# EAGLE schematic Iridium Carrier (2) (EAGLE 9.5.1)

## Sheet 1 of 3
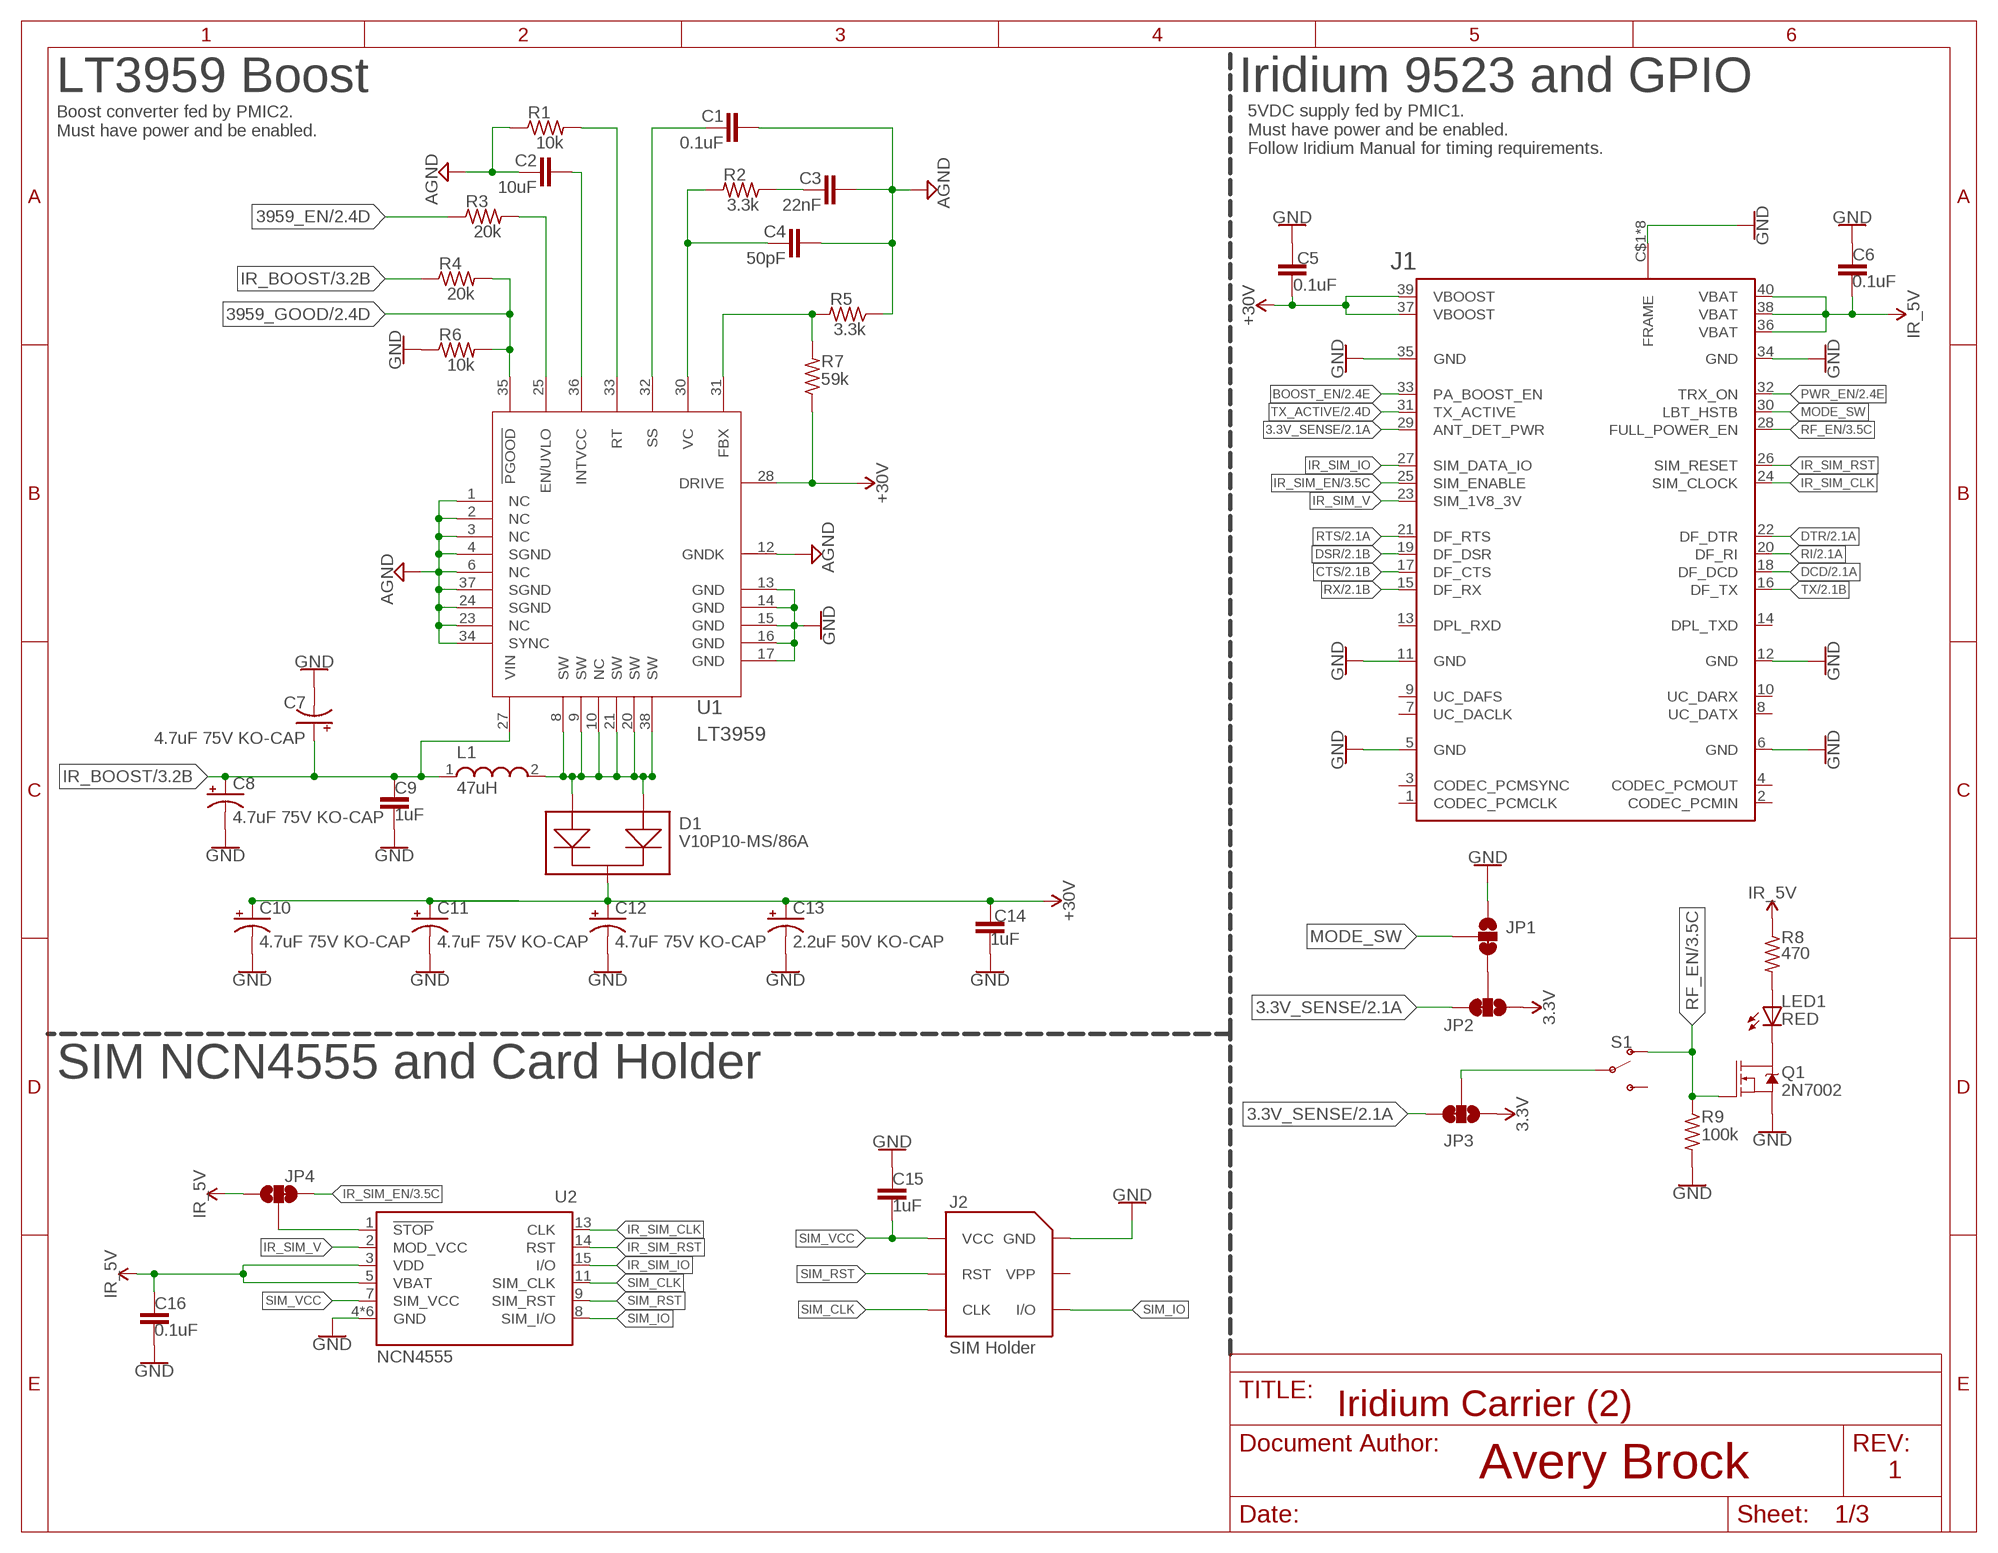
[diagram p0: schematic, sheet 1]
FRAME1 (FRAME_A_L): TITLE: Iridium 9523 Carrier

### Parts
C1  0.1uF  C-EUC0603  [C0603]
C2  10uF  C-EUC0603  [C0603]
C3  22nF  C-EUC0603  [C0603]
C4  50pF  C-EUC0603  [C0603]
C5  0.1uF  C-EUC0603  [C0603]
C6  0.1uF  C-EUC0603  [C0603]
C7  4.7uF 75V KO-CAP  CPOL-USD/7343-31R  [D/7343-31R]
C8  4.7uF 75V KO-CAP  CPOL-USD/7343-31R  [D/7343-31R]
C9  1uF  C-EUC0603  [C0603]
C10  4.7uF 75V KO-CAP  CPOL-USD/7343-31R  [D/7343-31R]
C11  4.7uF 75V KO-CAP  CPOL-USD/7343-31R  [D/7343-31R]
C12  4.7uF 75V KO-CAP  CPOL-USD/7343-31R  [D/7343-31R]
C13  2.2uF 50V KO-CAP  CPOL-USCT3528  [CT3528]
C14  1uF  C-EUC0603  [C0603]
C15  1uF  C-EUC0603  [C0603]
C16  0.1uF  C-EUC0603  [C0603]
D1  V10P10-MS/86A  [DIODE_TO-277A]
J1  Molex 0541020404  IRIDIUM-9523DEFAULT  [IRIDIUM-9523]
J2  SIM Holder  SIMHOLDERSIM  [SIMHOLDER]
JP1  OP MODE  JUMPER-SMT_3_1-NC_TRACE_SILK  [SMT-JUMPER_3_1-NC_TRACE_SILK]
JP2  Sense V  JUMPER-SMT_3_1-NC_TRACE_SILK  [SMT-JUMPER_3_1-NC_TRACE_SILK]
JP3  Sense V  JUMPER-SMT_3_1-NC_TRACE_SILK  [SMT-JUMPER_3_1-NC_TRACE_SILK]
JP4  SIM_STOP  JUMPER-SMT_3_1-NC_TRACE_SILK  [SMT-JUMPER_3_1-NC_TRACE_SILK]
L1  47uH  WE-HCI_1890  [WE-HCI_1890]
LED1  RED  LEDCHIP-LED0805  [CHIP-LED0805]
Q1  2N7002  MOSFET-NCH-AO3404A  [SOT23-3]
R1  10k  R-US_R0603  [R0603]
R2  3.3k  R-US_R0603  [R0603]
R3  20k  R-US_R0603  [R0603]
R4  20k  R-US_R0603  [R0603]
R5  3.3k  R-US_R0603  [R0603]
R6  10k  R-US_R0603  [R0603]
R7  59k  R-US_R0603  [R0603]
R8  470  R-US_R0603  [R0603]
R9  100k  R-US_R0603  [R0603]
S1  FULL RF PWR  SWITCH-SPDT-PTH-11.6X4.0MM  [SWITCH_SPDT_PTH_11.6X4.0MM]
U1  LT3959  [QFN-36_UHEMA]
U2  DAVID-HANDY_ON_NCN4555DEFAULT  [DAVID-HANDY_QFN16-3X3MM]

### Nets
3.3V: JP2.1 JP3.1 ; also sheet 2,3
3.3V_SENSE: J1.29(ANT_DET_PWR) JP2.3 JP3.3 ; also sheet 2,3
3959_EN: R3.1 ; also sheet 2
3959_GOOD: R4.2 R6.2 U1.35(!PGOOD!) ; also sheet 2
AGND: C1.2 C2.1 C3.2 C4.2 R1.1 R5.1 U1.1(NC) U1.2(NC) U1.3(NC) U1.4(SGND) U1.6(NC) U1.12(GNDK) U1.23(NC) U1.24(SGND) U1.34(SYNC) U1.37(SGND)
BOOST_EN: J1.33(PA_BOOST_EN) ; also sheet 2,3
CTS: J1.17(DF_CTS) ; also sheet 2
DCD: J1.18(DF_DCD) ; also sheet 2
DSR: J1.19(DF_DSR) ; also sheet 2
DTR: J1.22(DF_DTR) ; also sheet 2
GND: C5.1 C6.1 C7.- C8.- C9.2 C10.- C11.- C12.- C13.- C14.2 C15.1 C16.1 J1.5(GND) J1.6(GND) J1.11(GND) J1.12(GND) J1.34(GND) J1.35(GND) J1.C$1(FRAME) J1.C$2(FRAME) J1.C$3(FRAME) J1.C$4(FRAME) J1.C$5(FRAME) J1.C$6(FRAME) J1.C$7(FRAME) J1.C$8(FRAME) J2.C5(GND) JP1.1 Q1.2(S) R6.1 R9.2 U1.13(GND) U1.14(GND) U1.15(GND) U1.16(GND) U1.17(GND) U2.4(GND) U2.6(GND) U2.10(GND) U2.12(GND) U2.16(GND) U2.EXT(GND) ; also sheet 2,3
IR_BOOST: C7.+ C8.+ C9.1 L1.1 R4.1 U1.27(VIN) ; also sheet 3
IR_SIM_CLK: J1.24(SIM_CLOCK) U2.13(CLK)
IR_SIM_EN: J1.25(SIM_ENABLE) JP4.3 ; also sheet 3
IR_SIM_IO: J1.27(SIM_DATA_IO) U2.15(I/O)
IR_SIM_RST: J1.26(SIM_RESET) U2.14(RST)
IR_SIM_V: J1.23(SIM_1V8_3V) U2.2(MOD_VCC)
MODE_SW: J1.30(LBT_HSTB) JP1.2
N$1: JP4.2 U2.1(!STOP)
N$2: D1.1 D1.2 L1.2 U1.8(SW) U1.9(SW) U1.10(NC) U1.20(SW) U1.21(SW) U1.38(SW)
N$3: C2.2 U1.36(INTVCC)
N$4: JP1.3 JP2.2
N$5: C1.1 U1.32(SS)
N$6: R1.2 U1.33(RT)
N$7: LED1.C Q1.3(D)
N$8: C4.1 R2.2 U1.30(VC)
N$9: C3.1 R2.1
N$10: R5.2 R7.2 U1.31(FBX)
N$11: JP3.2 S1.2(P)
N$13: LED1.A R8.2
N$33: R3.2 U1.25(EN/UVLO)
PWR_EN: J1.32(TRX_ON) ; also sheet 2
RF_EN: J1.28(FULL_POWER_EN) Q1.1(G) R9.1 S1.1(O) ; also sheet 3
RI: J1.20(DF_RI) ; also sheet 2
RTS: J1.21(DF_RTS) ; also sheet 2
RX: J1.15(DF_RX) ; also sheet 2
SIM_CLK: J2.C3(CLK) U2.11(SIM_CLK)
SIM_IO: J2.C7(I/O) U2.8(SIM_I/O)
SIM_RST: J2.C2(RST) U2.9(SIM_RST)
SIM_VCC: C15.2 J2.C1(VCC) U2.7(SIM_VCC)
TX: J1.16(DF_TX) ; also sheet 2
TX_ACTIVE: J1.31(TX_ACTIVE) ; also sheet 2,3
V_BATT: C6.2 C16.2 J1.36(VBAT) J1.38(VBAT) J1.40(VBAT) JP4.1 R8.1 U2.3(VDD) U2.5(VBAT) ; supply symbol labelled IR_5V ; also sheet 3
VCC [30V]: C5.2 C10.+ C11.+ C12.+ C13.+ C14.1 D1.3 J1.37(VBOOST) J1.39(VBOOST) R7.1 U1.28(DRIVE) ; supply symbol labelled +30V
Unconnected: J1.1(CODEC_PCMCLK) J1.2(CODEC_PCMIN) J1.3(CODEC_PCMSYNC) J1.4(CODEC_PCMOUT) J1.7(UC_DACLK) J1.8(UC_DATX) J1.9(UC_DAFS) J1.10(UC_DARX) J1.13(DPL_RXD) J1.14(DPL_TXD) J2.C6(VPP) S1.3(S)

### Notes on the sheet
- LT3959 Boost | Iridium 9523 and GPIO
- Boost converter fed by PMIC2.
  Must have power and be enabled.
- 5VDC supply fed by PMIC1.
  Must have power and be enabled.
  Follow Iridium Manual for timing requirements.
- SIM NCN4555 and Card Holder
- NCN4555
- 1

## Sheet 2 of 3
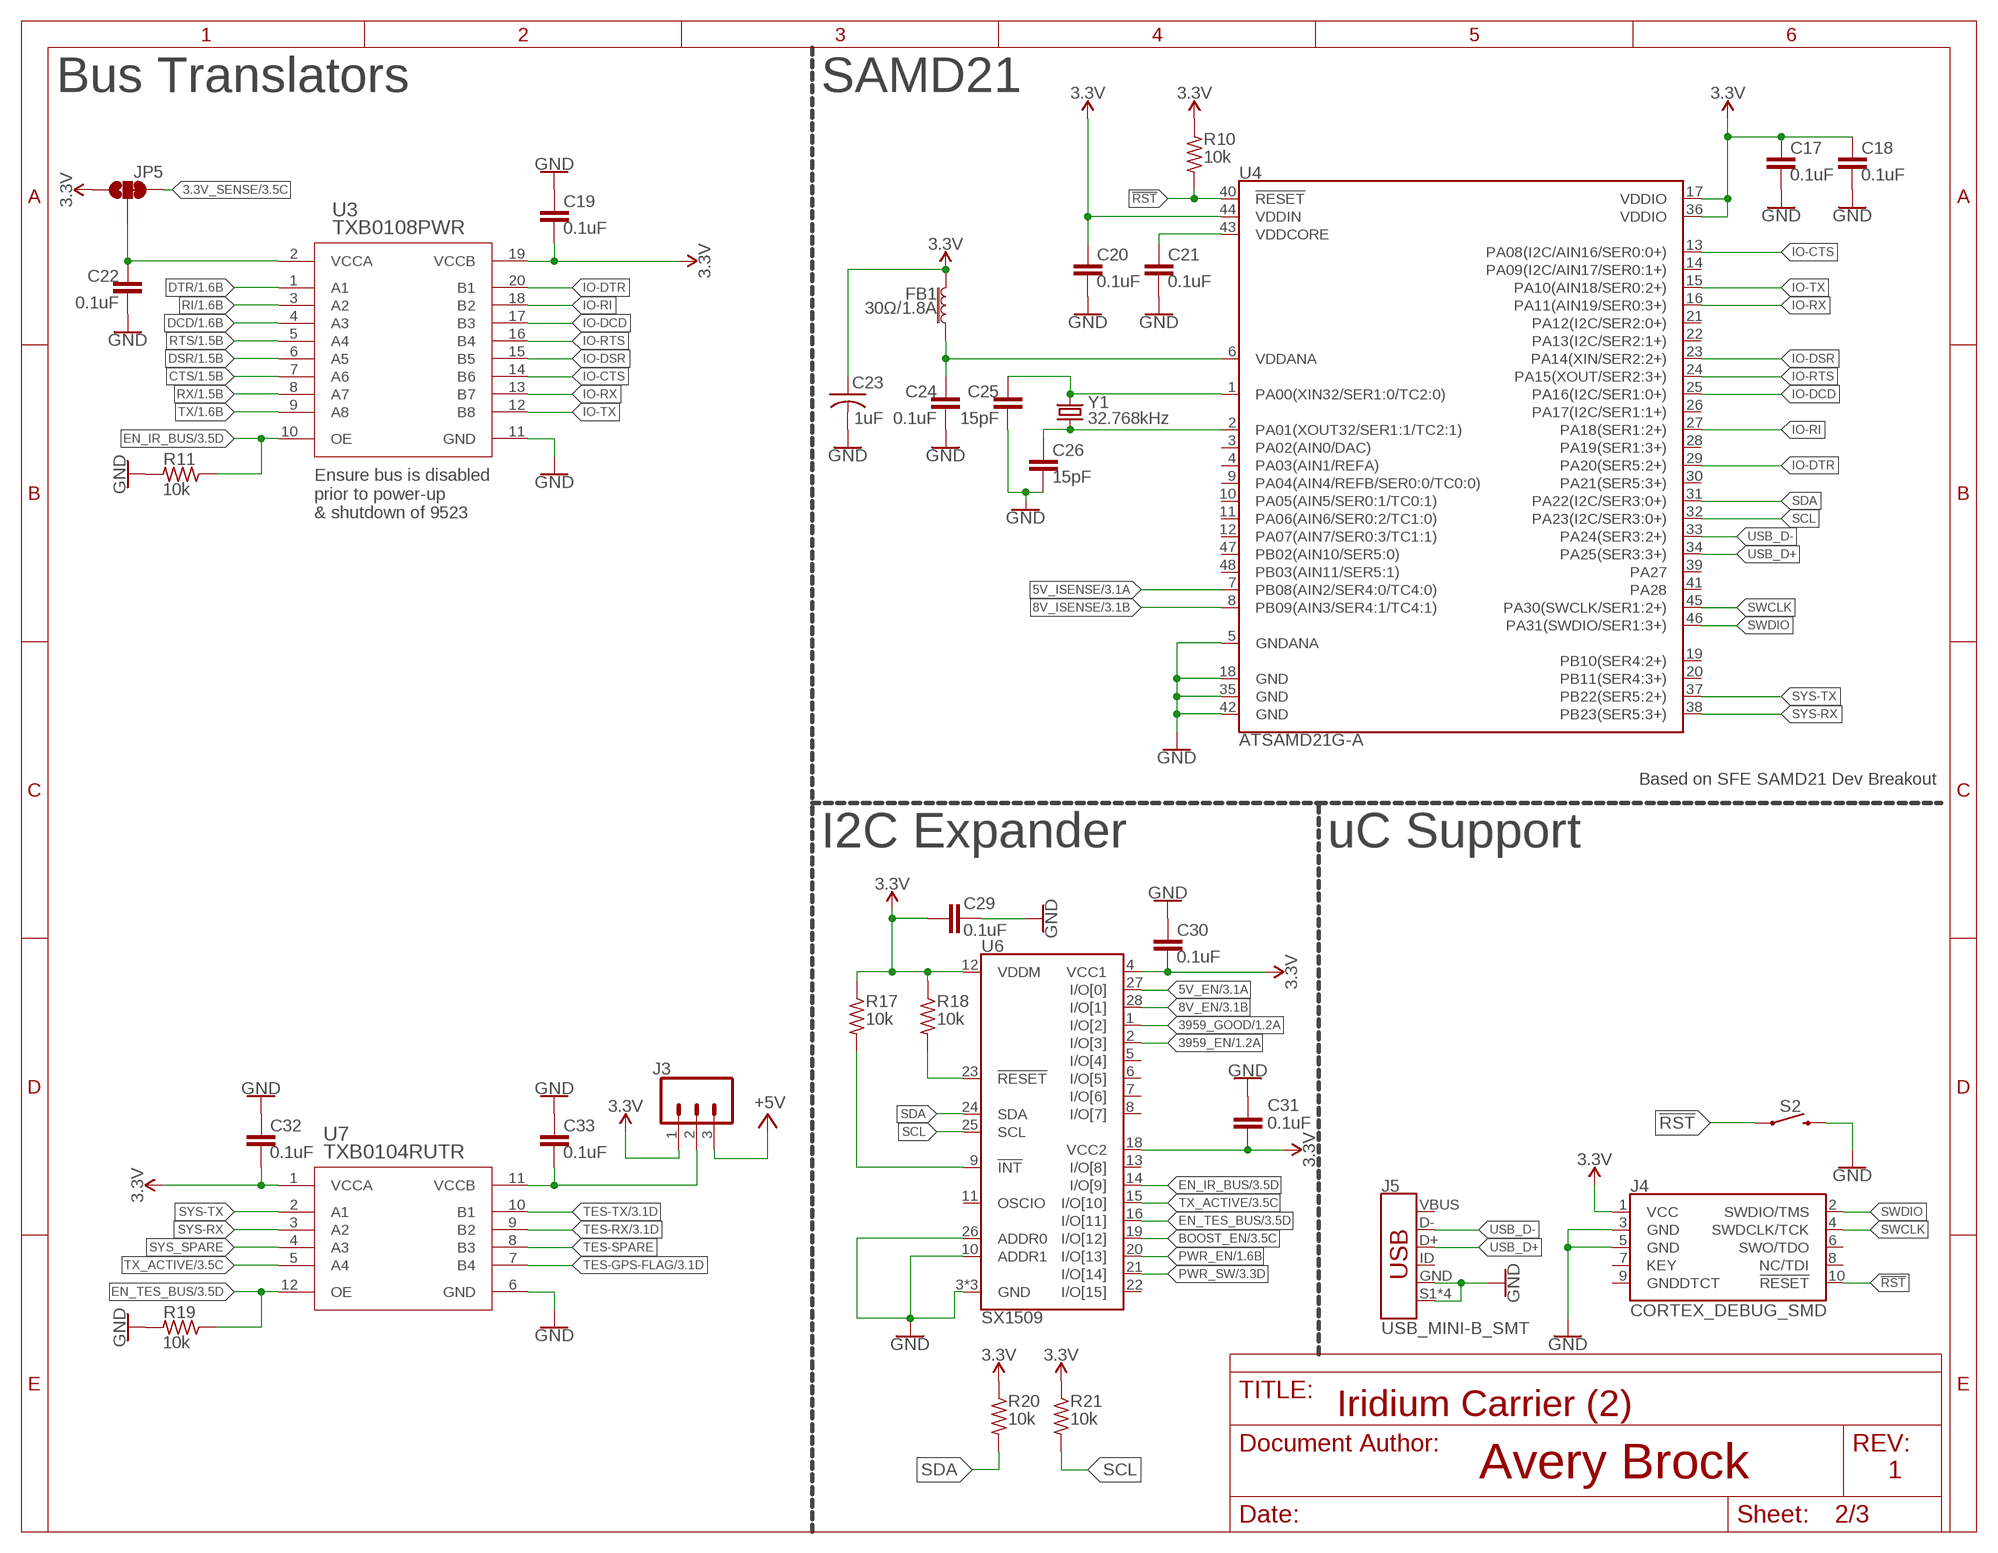
[diagram p1: schematic, sheet 2]
FRAME2 (FRAME_A_L): TITLE: Iridium 9523 Carrier

### Parts
C17  0.1uF  C-EUC0603  [C0603]
C18  0.1uF  C-EUC0603  [C0603]
C19  0.1uF  C-EUC0603  [C0603]
C20  0.1uF  C-EUC0603  [C0603]
C21  0.1uF  C-EUC0603  [C0603]
C22  0.1uF  C-EUC0603  [C0603]
C23  1uF  C-USC0805  [C0805]
C24  0.1uF  C-EUC0603  [C0603]
C25  15pF  C-EUC0603  [C0603]
C26  15pF  C-EUC0603  [C0603]
C29  0.1uF  C-EUC0603  [C0603]
C30  0.1uF  C-EUC0603  [C0603]
C31  0.1uF  C-EUC0603  [C0603]
C32  0.1uF  C-EUC0603  [C0603]
C33  0.1uF  C-EUC0603  [C0603]
FB1  30Ω/1.8A  FERRITE_BEAD-0603  [0603]
J3  455-1750-1-ND  CONN_03  [1X03]
J4  CORTEX_DEBUG_SMD  [SAMTECH_FTSH-105-01]
J5  USB_MINI-B_SMT  [USB-MINIB]
JP5  BUS_V  JUMPER-SMT_3_1-NC_TRACE_SILK  [SMT-JUMPER_3_1-NC_TRACE_SILK]
R10  10k  R-US_R0603  [R0603]
R11  10k  R-US_R0603  [R0603]
R17  10k  R-US_R0603  [R0603]
R18  10k  R-US_R0603  [R0603]
R19  10k  R-US_R0603  [R0603]
R20  10k  R-US_R0603  [R0603]
R21  10k  R-US_R0603  [R0603]
S2  RST BTN  MOMENTARY-SWITCH-SPST-SMD-6.0X3.5MM  [TACTILE_SWITCH_SMD_6.0X3.5MM]
U3  TXB0108PWR  [PW20]
U4  ATSAMD21G-A  [TQFP-48]
U6  SX1509  [QFN-28]
U7  TXB0104RUTR  [RUT12]
Y1  32.768kHz  CRYSTAL-32.768KHZSMD-3.2X1.5  [CRYSTAL-SMD-3.2X1.5MM]

### Nets
3.3V: C17.1 C18.1 C19.2 C20.1 C23.1 C29.1 C30.2 C31.2 C32.2 FB1.2 J3.1 J4.1(VCC) JP5.1 R10.1 R17.1 R18.1 R20.1 R21.1 U3.19(VCCB) U4.17(VDDIO) U4.36(VDDIO) U4.44(VDDIN) U6.4(VCC1) U6.12(VDDM) U6.18(VCC2) U7.1(VCCA) ; also sheet 1,3
3.3V_SENSE: JP5.3 ; also sheet 1,3
5V_EN: U6.27(I/O[0]) ; also sheet 3
5V_ISENSE: U4.7(PB08(AIN2/SER4:0/TC4:0)) ; also sheet 3
8V_EN: U6.28(I/O[1]) ; also sheet 3
8V_ISENSE: U4.8(PB09(AIN3/SER4:1/TC4:1)) ; also sheet 3
3959_EN: U6.2(I/O[3]) ; also sheet 1
3959_GOOD: U6.1(I/O[2]) ; also sheet 1
!RST: J4.10(!RESET) R10.2 S2.1 U4.40(!RESET!)
+5V: J3.3 ; also sheet 3
BOOST_EN: U6.19(I/O[12]) ; also sheet 1,3
CTS: U3.7(A6) ; also sheet 1
DCD: U3.4(A3) ; also sheet 1
DSR: U3.6(A5) ; also sheet 1
DTR: U3.1(A1) ; also sheet 1
EN_IR_BUS: R11.1 U3.10(OE) U6.14(I/O[9]) ; also sheet 3
EN_TES_BUS: R19.1 U6.16(I/O[11]) U7.12(OE) ; also sheet 3
GND: C17.2 C18.2 C19.1 C20.2 C21.2 C22.1 C23.2 C24.2 C25.2 C26.2 C29.2 C30.1 C31.1 C32.1 C33.1 J4.3(GND) J4.5(GND) J5.GND J5.S1(SHIELD) J5.S2(SHIELD) J5.S3(SHIELD) J5.S4(SHIELD) R11.2 R19.2 S2.2 U3.11(GND) U4.5(GNDANA) U4.18(GND) U4.35(GND) U4.42(GND) U6.3(GND) U6.10(ADDR1) U6.17(GND) U6.26(ADDR0) U6.29(GND) U7.6(GND) ; also sheet 1,3
IO-CTS: U3.14(B6) U4.13(PA08(I2C/AIN16/SER0:0+))
IO-DCD: U3.17(B3) U4.25(PA16(I2C/SER1:0+))
IO-DSR: U3.15(B5) U4.23(PA14(XIN/SER2:2+))
IO-DTR: U3.20(B1) U4.29(PA20(SER5:2+))
IO-RI: U3.18(B2) U4.27(PA18(SER1:2+))
IO-RTS: U3.16(B4) U4.24(PA15(XOUT/SER2:3+))
IO-RX: U3.13(B7) U4.16(PA11(AIN19/SER0:3+))
IO-TX: U3.12(B8) U4.15(PA10(AIN18/SER0:2+))
N$14: C22.2 JP5.2 U3.2(VCCA)
N$15: C33.2 J3.2 U7.11(VCCB)
N$17: C24.1 FB1.1 U4.6(VDDANA)
N$18: C21.1 U4.43(VDDCORE)
N$19: C25.1 U4.1(PA00(XIN32/SER1:0/TC2:0)) Y1.P$2
N$20: C26.1 U4.2(PA01(XOUT32/SER1:1/TC2:1)) Y1.P$1
N$71: R17.2 U6.9(!INT)
N$72: R18.2 U6.23(!RESET)
PWR_EN: U6.20(I/O[13]) ; also sheet 1
PWR_SW: U6.21(I/O[14]) ; also sheet 3
RI: U3.3(A2) ; also sheet 1
RTS: U3.5(A4) ; also sheet 1
RX: U3.8(A7) ; also sheet 1
SCL: R21.2 U4.32(PA23(I2C/SER3:0+)) U6.25(SCL)
SDA: R20.2 U4.31(PA22(I2C/SER3:0+)) U6.24(SDA)
SWCLK: J4.4(SWDCLK/TCK) U4.45(PA30(SWCLK/SER1:2+))
SWDIO: J4.2(SWDIO/TMS) U4.46(PA31(SWDIO/SER1:3+))
SYS-RX: U4.38(PB23(SER5:3+)) U7.3(A2)
SYS-TX: U4.37(PB22(SER5:2+)) U7.2(A1)
SYS_SPARE: U7.4(A3)
TES-GPS-FLAG: U7.7(B4) ; also sheet 3
TES-RX: U7.9(B2) ; also sheet 3
TES-SPARE: U7.8(B3)
TES-TX: U7.10(B1) ; also sheet 3
TX: U3.9(A8) ; also sheet 1
TX_ACTIVE: U6.15(I/O[10]) U7.5(A4) ; also sheet 1,3
USB_D+: J5.D+ U4.34(PA25(SER3:3+))
USB_D-: J5.D- U4.33(PA24(SER3:2+))
Unconnected: J4.6(SWO/TDO) J4.7(KEY) J4.8(NC/TDI) J4.9(GNDDTCT) J5.ID U4.3(PA02(AIN0/DAC)) U4.4(PA03(AIN1/REFA)) U4.9(PA04(AIN4/REFB/SER0:0/TC0:0)) U4.10(PA05(AIN5/SER0:1/TC0:1)) U4.11(PA06(AIN6/SER0:2/TC1:0)) U4.12(PA07(AIN7/SER0:3/TC1:1)) U4.14(PA09(I2C/AIN17/SER0:1+)) U4.19(PB10(SER4:2+)) U4.20(PB11(SER4:3+)) U4.21(PA12(I2C/SER2:0+)) U4.22(PA13(I2C/SER2:1+)) U4.26(PA17(I2C/SER1:1+)) U4.28(PA19(SER1:3+)) U4.30(PA21(SER5:3+)) U4.39(PA27) U4.41(PA28) U4.47(PB02(AIN10/SER5:0)) U4.48(PB03(AIN11/SER5:1)) U6.5(I/O[4]) U6.6(I/O[5]) U6.7(I/O[6]) U6.8(I/O[7]) U6.11(OSCIO) U6.13(I/O[8]) U6.22(I/O[15])

### Notes on the sheet
- Bus Translators | SAMD21
- Ensure bus is disabled 
  prior to power-up
  & shutdown of 9523
- Based on SFE SAMD21 Dev Breakout
- I2C Expander | uC Support
- 1

## Sheet 3 of 3
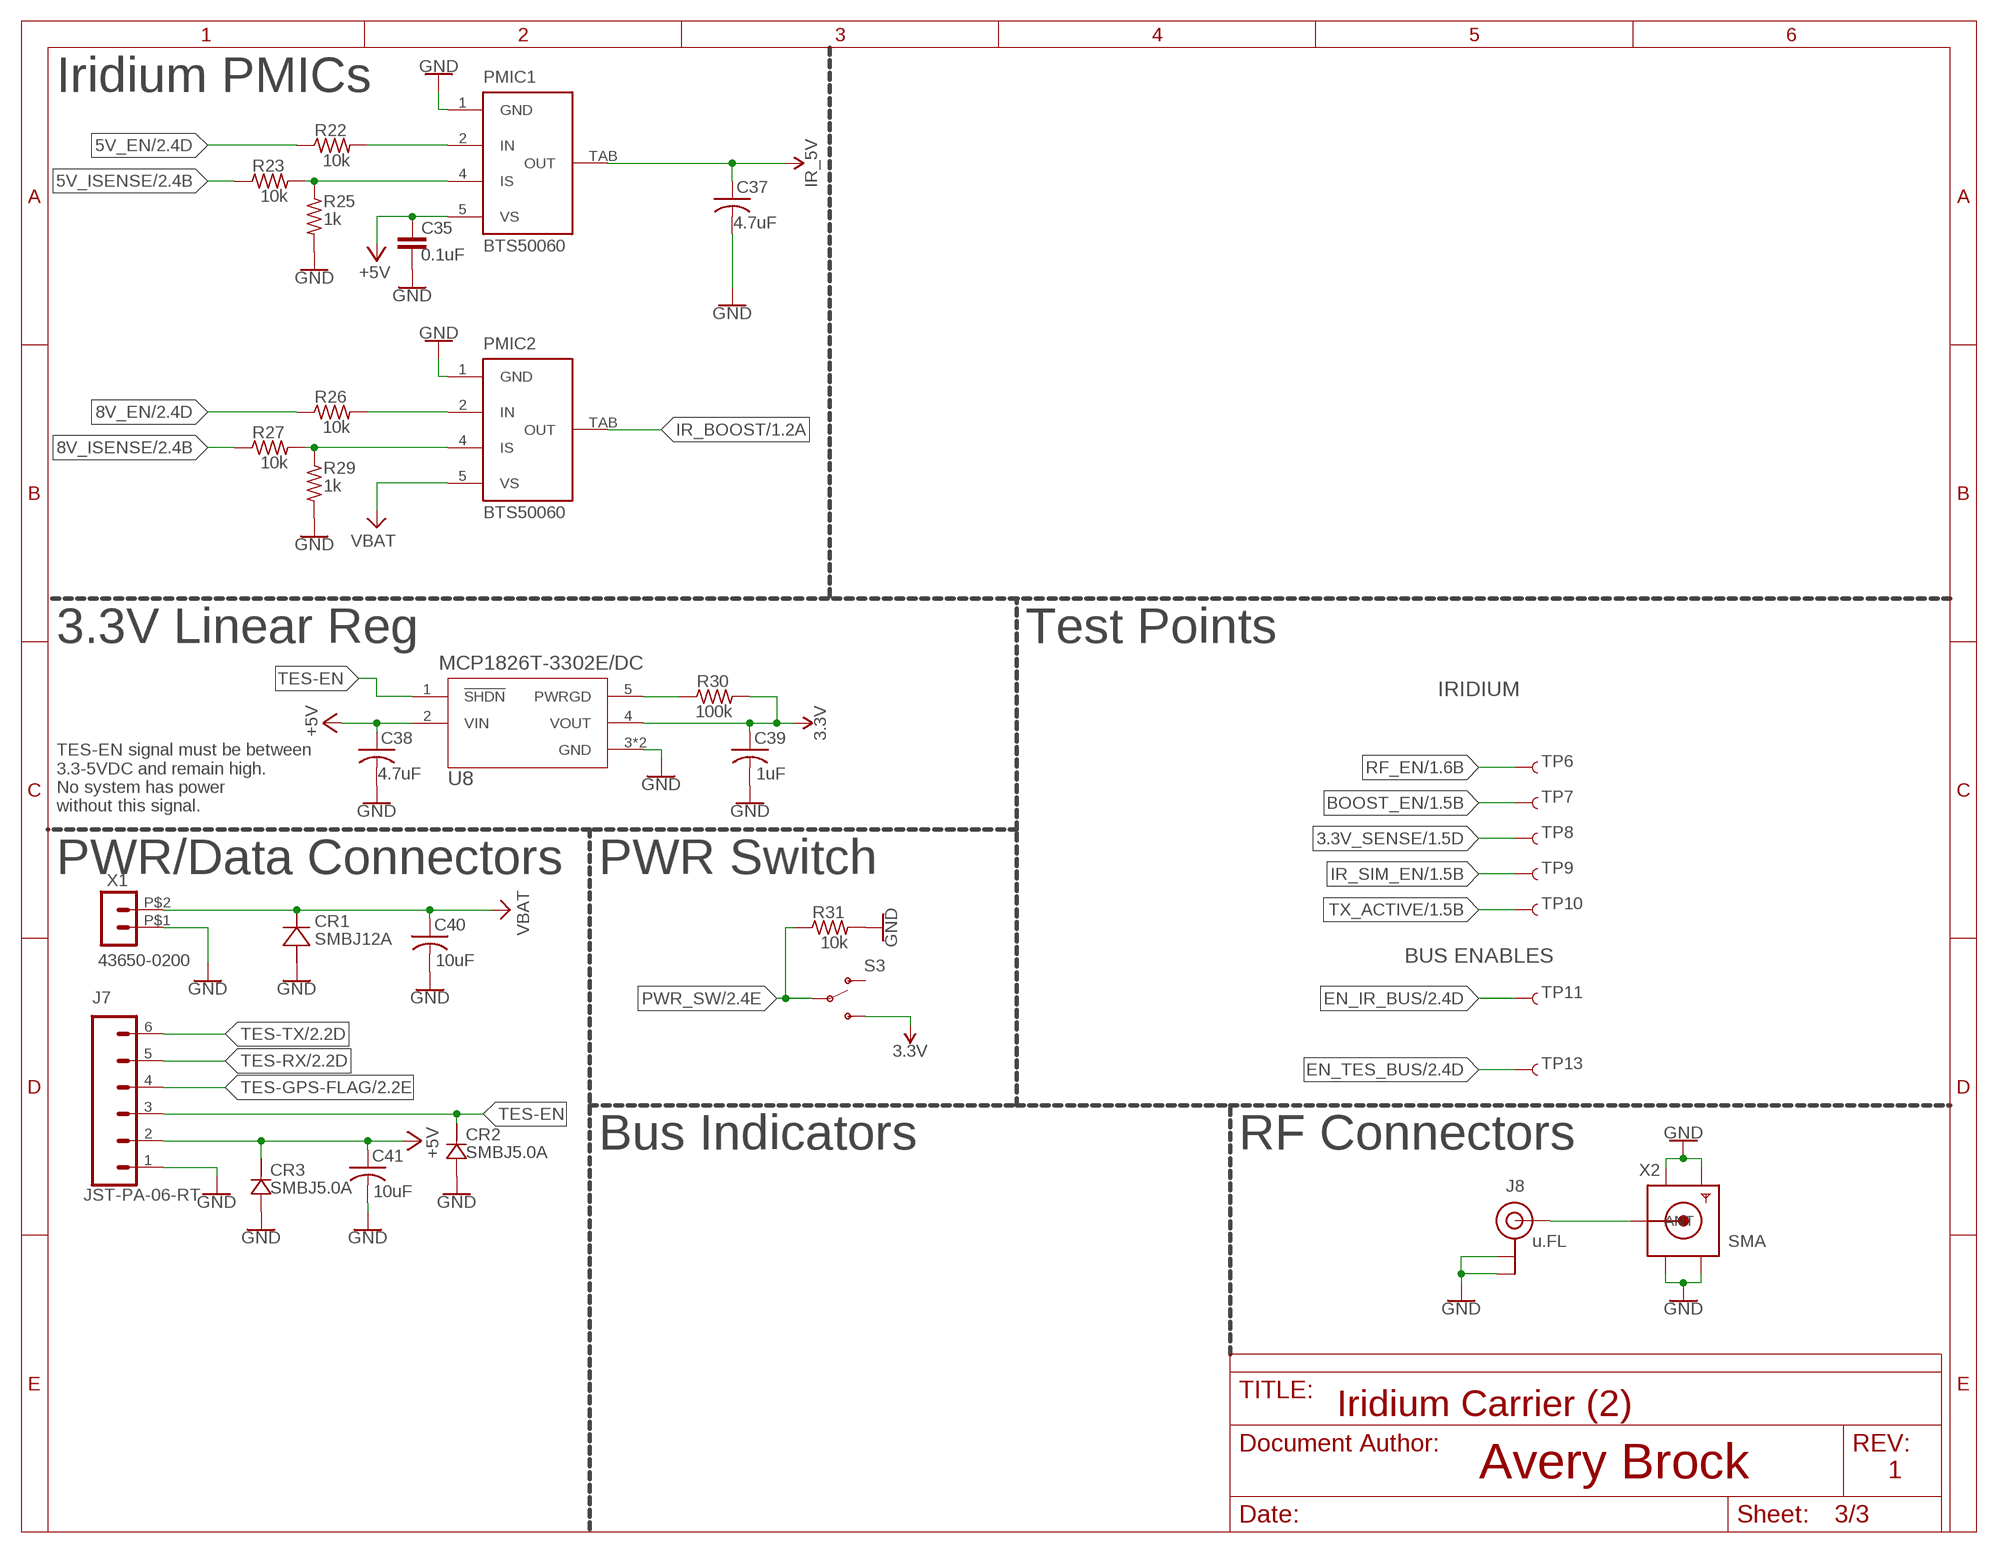
[diagram p2: schematic, sheet 3]
FRAME3 (FRAME_A_L): TITLE: Iridium 9523 Carrier

### Parts
C35  0.1uF  C-EUC0603  [C0603]
C37  4.7uF  C-USC1206  [C1206]
C38  4.7uF  C-USC1206  [C1206]
C39  1uF  C-USC0805  [C0805]
C40  10uF  C-USC1206  [C1206]
C41  10uF  C-USC1206  [C1206]
CR1  SMBJ12A  [SMB]
CR2  SMBJ5.0A  [DIODE_DO214AA]
CR3  SMBJ5.0A  [DIODE_DO214AA]
J7  JST-PA-06-RT  [1X6-JST-PA]
J8  U.FL  [U.FL]
PMIC1  BTS50060  [TO252-5-11]
PMIC2  BTS50060  [TO252-5-11]
R22  10k  R-US_R0603  [R0603]
R23  10k  R-US_R0603  [R0603]
R25  1k  R-US_R0603  [R0603]
R26  10k  R-US_R0603  [R0603]
R27  10k  R-US_R0603  [R0603]
R29  1k  R-US_R0603  [R0603]
R30  100k  R-US_R0603  [R0603]
R31  10k  R-US_R0603  [R0603]
S3  PWR SW  SWITCH-SPDT-PTH-11.6X4.0MM  [SWITCH_SPDT_PTH_11.6X4.0MM]
TP6  TEST-POINT3X4  [PAD.03X.04]
TP7  TEST-POINT3X4  [PAD.03X.04]
TP8  TEST-POINT3X4  [PAD.03X.04]
TP9  TEST-POINT3X4  [PAD.03X.04]
TP10  TEST-POINT3X4  [PAD.03X.04]
TP11  TEST-POINT3X4  [PAD.03X.04]
TP13  TEST-POINT3X4  [PAD.03X.04]
U8  MCP1826T-3302E/DC  [SOT-223_5MC]
X1  43650-0200  HEADER_POS2_43650-0200  [43650-0200]
X2  SMACONNECTOR  [SMA90_DIP]

### Nets
3.3V: C39.1 R30.2 S3.3(S) U8.4(VOUT) ; also sheet 1,2
3.3V_SENSE: TP8.P$1 ; also sheet 1,2
5V_EN: R22.1 ; also sheet 2
5V_ISENSE: R23.1 ; also sheet 2
8V_EN: R26.1 ; also sheet 2
8V_ISENSE: R27.1 ; also sheet 2
+5V: C35.1 C38.1 C41.1 CR3.1 J7.2 PMIC1.5(VS) U8.2(VIN) ; also sheet 2
BOOST_EN: TP7.P$1 ; also sheet 1,2
EN_IR_BUS: TP11.P$1 ; also sheet 2
EN_TES_BUS: TP13.P$1 ; also sheet 2
GND: C35.2 C37.2 C38.2 C39.2 C40.2 C41.2 CR1.2(CATHODE2) CR2.2 CR3.2 J7.1 J8.1(GND) J8.2(GND) PMIC1.1(GND) PMIC2.1(GND) R25.2 R29.2 R31.2 U8.3(GND) U8.P$1(GND) X1.P$1 X2.GND1 X2.GND2 X2.GND3 X2.GND4 ; also sheet 1,2
IR_BOOST: PMIC2.TAB(OUT) ; also sheet 1
IR_SIM_EN: TP9.P$1 ; also sheet 1
N$12: R30.1 U8.5(PWRGD)
N$26: PMIC2.4(IS) R27.2 R29.1
N$27: PMIC2.2(IN) R26.2
N$30: PMIC1.4(IS) R23.2 R25.1
N$31: PMIC1.2(IN) R22.2
N$75: J8.FEED(SIGNAL) X2.ANTENNA(ANT)
PWR_SW: R31.1 S3.2(P) ; also sheet 2
RF_EN: TP6.P$1 ; also sheet 1
TES-EN: CR2.1 J7.3 U8.1(!SHDN)
TES-GPS-FLAG: J7.4 ; also sheet 2
TES-RX: J7.5 ; also sheet 2
TES-TX: J7.6 ; also sheet 2
TX_ACTIVE: TP10.P$1 ; also sheet 1,2
V_BATT: C37.1 PMIC1.TAB(OUT) ; supply symbol labelled IR_5V ; also sheet 1
VBAT: C40.1 CR1.1(ANODE1) PMIC2.5(VS) X1.P$2
Unconnected: S3.1(O)

### Notes on the sheet
- Iridium PMICs
- 3.3V Linear Reg | Test Points
- IRIDIUM
- TES-EN signal must be between
  3.3-5VDC and remain high. 
  No system has power 
  without this signal.
- PWR/Data Connectors | PWR Switch
- BUS ENABLES
- Bus Indicators | RF Connectors
- u.FL | SMA
- 1

## Power pins joined to a net without a drawn wire
VBUS: J5.VBUS

## Library data of the parts
C1-C6 C9 C14-C22 C24-C26 C29-C33 C35 = rcl:C-EU: CAPACITOR, European symbol; SPICEPREFIX: C
C7 C8 C10-C13 = rcl:CPOL-US: POLARIZED CAPACITOR, American symbol; SPICEPREFIX: C
C23 C37-C41 = adafruit:C-US: CAPACITOR, American symbol
CR1 = SMBJ12A:SMBJ12A; MANUFACTURER_PART_NUMBER: SMBJ12A; VENDOR: AVX Corporation
CR2 CR3 = SMBJ5 TVS:SMBJ5.0A; MANUFACTURER_PART_NUMBER: SMBJ5.0A; VENDOR: AVX Corporation
D1 = V10P10:V10P10-MS/86A
FB1 = SparkFun-Coils:FERRITE_BEAD: Ferrite Bead (blocks, cores, rings, chokes, etc.) Inductor with layers of ferrite used to suppress high frequencies. Often used to isolate high frequency noise. SparkFun Products: IOIO-OTG - V2.2 <https://www.sparkfun.com/products/13613> SparkFun SAMD21 Mini Breakout <https://www.sparkfun.com/products/13664> SparkFun 6 Degrees of Freedom Breakout - LSM6DS3 <https://www.sparkfun.com/products/13339> SparkFun SAMD21 Dev Breakout <https://www.sparkfun.com/products/13672>; PROD_ID: NDUC-13805
J1 = Iridium-9523:IRIDIUM-9523: Molex 53885-0408 Iridium 9523 pinout
J2 = SparkFun-Connectors:SIMHOLDER: SIM Cellular Card Socket SMT 6 pin standard connection. SparkFun Products: SIM Socket <https://www.sparkfun.com/products/548> SparkFun Cellular Shield - MG2639 <https://www.sparkfun.com/products/13120> SparkFun SIM Card Socket Breakout <https://www.sparkfun.com/products/573>; PROD_ID: CONN-08536; SF_ID: PRT-00548
J3 = SparkFun-Connectors:CONN_03: Multi connection point. Often used as Generic Header-pin footprint for 0.1 inch spaced/style header connections On any of the 0.1 inch spaced packages, you can populate with these: Break Away Headers - Straight <https://www.sparkfun.com/products/116> (PRT-00116) Break Away Male Headers - Right Angle <https://www.sparkfun.com/products/553> (PRT-00553) Female Headers <https://www.sparkfun.com/products/115> (PRT-00115) Break Away Headers - Machine Pin <https://www.sparkfun.com/products/117> (PRT-00117) Break Away Female Headers - Swiss Machine Pin <https://www.sparkfun.com/products/743> (PRT-00743) Stackable Header - 3 Pin (Female, 0.1") <https://www.sparkfun.com/products/13875> (PRT-13875) For SCREWTERMINALS and SPRING TERMINALS visit here: Screw Terimnals on SparkFun.com <https://www.sparkfun.com/search/results?term=Screw+Terminals> (5mm/3.5mm/2.54mm spacing) This device is also useful as a general connection point to wire up your design to another part of your project. Our various solder wires solder well into these plated through hole pads. Hook-Up Wire - Assortment (Stranded, 22 AWG) <https://www.sparkfun.com/products/11375> (PRT-11375) Hook-Up Wire - Assortment (Solid Core, 22 AWG) <https://www.sparkfun.com/products/11367> (PRT-11367) View the entire wire category on our website here <https://www.sparkfun.com/categories/141> Special notes: Molex polarized connector foot print use with SKU : PRT-08232 with associated crimp pins and housings.; PROD_ID: XXX-00000
J4 = SparkFun-Connectors:CORTEX_DEBUG: Cortex Debug Connector - 10 pin Supports JTAG debug, Serial Wire debug, and Serial Wire Viewer. PTH and SMD connector options available. General Connector Information <http://infocenter.arm.com/help/topic/com.arm.doc.faqs/attached/13634/cortex_debug_connectors.pdf> Products: PTH Connector <http://www.digikey.com/product-detail/en/cnc-tech/3220-10-0100-00/1175-1627-ND/3883661> -via Digi-Key SparkFun PSoc <https://www.sparkfun.com/products/13229> SparkFun T <https://www.sparkfun.com/products/13810>
J5 = SparkFun-Connectors:USB_MINI-B: USB type Mini-B Connector Breaks out 5th pin, and includes shield pins if needed. SparkFun Products: SparkFun FTDI Basic Breakout <https://www.sparkfun.com/products/9716> SparkFun XBee Explorer USB <https://www.sparkfun.com/products/11812> SparkFun Redboard <https://www.sparkfun.com/products/12757>; PROD_ID: CONN-08193; SF_ID: PRT-00587
J7 = SparkFun-Connectors:JST-PA-06-RT
J8 = SparkFun-Connectors:U.FL: SMD Antenna Connector - U.FL 2mm height, 3.0mm x 3.0mm receptacle size. SparkFun Products: SparkFun WiFi Shield - ESP8266 <https://www.sparkfun.com/products/13287> SparkFun ESP8266 Thing <https://www.sparkfun.com/products/13231> SparkFun MiniGen - Pro Mini Signal Generator Shield <https://www.sparkfun.com/products/11420>; PROD_ID: CONN-09193; SF_ID: WRL-09144
JP1-JP5 = SparkFun-Jumpers:JUMPER-SMT_3_1-NC_TRACE: Normally closed trace jumper (1 of 2 connections) This jumper has a trace between two pads so it's normally closed (NC). The other connection is normally open (NO). Use a razor knife to open the connection. For best results follow the IPC guidelines for cutting traces: Cutout at least 0.063 mm (0.005 in). Remove all loose material to clean up the cut area. Seal the cut with an approved epoxy. Reapply solder to reclose the connection, or to close the NO connection.
L1 = Wurth_Elektronik_Passive_rev16c:WE-HCI: SMD Flat Wire High Current Inductor Characteristics Magnetically shielded Flat wire coil for low losses at high frequency Low stray field Operating temperature: –40 °C to +150/155 °C Applications Graphic cards Laptops Industrial computers Motherboards High current switching regulators DC/DC converter Polyphase-switching regulators Filter <http://katalog.we-online.de/media/images/eisos/IndHCI_pf2.jpg> Details see: http://katalog.we-online.de/en/pbs/WE-HCI? Updated by Dan Xu 2014-07-07 2014 (C) Wurth Elektronik
LED1 = adafruit:LED: LED OSRAM: - CHIPLED LG R971, LG N971, LY N971, LG Q971, LY Q971, LO R971, LY R971 LH N974, LH R974 LS Q976, LO Q976, LY Q976 LO Q996 - Hyper CHIPLED LW Q18S LB Q993, LB Q99A, LB R99A - SideLED LS A670, LO A670, LY A670, LG A670, LP A670 LB A673, LV A673, LT A673, LW A673 LH A674 LY A675 LS A676, LA A676, LO A676, LY A676, LW A676 LS A679, LY A679, LG A679 - Hyper Micro SIDELED® LS Y876, LA Y876, LO Y876, LY Y876 LT Y87S - SmartLED LW L88C, LW L88S LB L89C, LB L89S, LG L890 LS L89K, LO L89K, LY L89K LS L896, LA L896, LO L896, LY L896 - TOPLED LS T670, LO T670, LY T670, LG T670, LP T670 LSG T670, LSP T670, LSY T670, LOP T670, LYG T670 LG T671, LOG T671, LSG T671 LB T673, LV T673, LT T673, LW T673 LH T674 LS T676, LA T676, LO T676, LY T676, LB T676, LH T676, LSB T676, LW T676 LB T67C, LV T67C, LT T67C, LS T67K, LO T67K, LY T67K, LW E67C LS E67B, LA E67B, LO E67B, LY E67B, LB E67C, LV E67C, LT E67C LW T67C LS T679, LY T679, LG T679 LS T770, LO T770, LY T770, LG T770, LP T770 LB T773, LV T773, LT T773, LW T773 LH T774 LS E675, LA E675, LY E675, LS T675 LS T776, LA T776, LO T776, LY T776, LB T776 LHGB T686 LT T68C, LB T68C - Hyper Mini TOPLED® LB M676 - Mini TOPLED Santana® LG M470 LS M47K, LO M47K, LY M47K Source: http://www.osram.convergy.de/
PMIC1 PMIC2 = infineon:BTS50060
Q1 = SparkFun-DiscreteSemi:MOSFET-NCH: N-channel MOSFETs Voltage controlled devices that allow control of high current outputs. SparkFun Products: SparkFun OpenScale <https://www.sparkfun.com/products/13261> SparkFun Digital Sandbox <https://www.sparkfun.com/products/12651> SparkFun Monster Moto Shield <https://www.sparkfun.com/products/10182> SparkFun MOSFET Power Controller <https://www.sparkfun.com/products/11214>; PROD_ID: TRANS-12988; VALUE: 5.8A/30V/35mΩ
R1-R11 R17-R23 R25-R27 R29-R31 = adafruit:R-US_: RESISTOR, American symbol
S1 S3 = SparkFun-Switches:SWITCH-SPDT: Single Pole, Double Throw (SPDT) Switch Single-pole, double-throw (SPDT) switch. Variant Overview SMD-AYZ0202 Surface Mount DPDT Switch <https://www.sparkfun.com/products/597> (COM-00597) Used on e.g. LilyPad Arduino USB - ATmega32U4 Board <https://www.sparkfun.com/products/12049> PTH-11.6X4.0MM SPDT Mini Power Switch <https://www.sparkfun.com/products/102> (COM-00102) Used on e.g. SparkFun Simon Says - Through-Hole Soldering Kit <https://www.sparkfun.com/products/10547> (KIT-10547) PTH-11.6X4.0MM-KIT KIT version of SPDT Mini Power Switch - Simplifies soldering by removing tStop of switch pins - only one side can be soldered. PTH-11.6X4.0MM-LOCK LOCK version of SPDT Mini Power Switch - Offset pins hold switch in place for easier soldering. SMD-RIGHT-ANGLE Surface Mount Right Angle Switch <https://www.sparkfun.com/products/10860> (COM-10860) Used on e.g. SparkFun ESP8266 Thing <https://www.sparkfun.com/products/13231>; PROD_ID: SWCH-08261; SF_SKU: COM-00102
S2 = SparkFun-Switches:MOMENTARY-SWITCH-SPST: Momentary Switch (Pushbutton) - SPST Normally-open (NO) SPST momentary switches (buttons, pushbuttons). Variants PTH-12MM - 12mm square, through-hole Momentary Pushbutton Switch - 12mm Square <https://www.sparkfun.com/products/9190> (COM-09190) PTH-6.0MM, PTH-6.0MM-KIT - 6.0mm square, through-hole Mini Pushbutton Switch <https://www.sparkfun.com/products/97> (COM-00097) KIT package intended for soldering kit's - only one side of pads' copper is exposed. PTH-RIGHT-ANGLE-KIT - Right-angle, through-hole Right Angle Tactile Button <https://www.sparkfun.com/products/10791> - Used on SparkFun BigTime Watch Kit <https://www.sparkfun.com/products/11734> SMD-12MM - 12mm square, surface-mount Tactile Button - SMD (12mm) <https://www.sparkfun.com/products/12993> (COM-12993) Used on SparkFun PicoBoard <https://www.sparkfun.com/products/11888> SMD-4.5MM - 4.5mm Square Trackball Switch Used on SparkFun Blackberry Trackballer Breakout <https://www.sparkfun.com/products/13169> SMD-4.6MMX2.8MM - 4.60mm x 2.80mm, surface mount Used on SparkFun SAMD21 Mini Breakout <https://www.sparkfun.com/products/13664> SMD-5.2MM, SMD-5.2-REDUNDANT - 5.2mm square, surface-mount Mini Pushbutton Switch - SMD <https://www.sparkfun.com/products/8720> (COM-08720) Used on Arduino Pro Mini <https://www.sparkfun.com/products/11114> REDUNDANT package connects both switch circuits together SMD-6.0X3.5MM - 6.0 x 3.5mm, surface mount Momentary Reset Switch SMD <https://www.sparkfun.com/products/8229> (COM-08229) SMD-6.2MM-TALL - 6.2mm square, surface mount Tactile Button - SMD (6mm) <https://www.sparkfun.com/products/12992> Used on SparkFun Digital Sandbox <https://www.sparkfun.com/products/12651> SMD-RIGHT-ANGLE - Right-angle, surface mount Used on SparkFun Block for Intel® Edison - Arduino <https://www.sparkfun.com/products/13036>; PROD_ID: SWCH-00815; SF_SKU: COM-08229
TP6-TP11 TP13 = SparkFun-Connectors:TEST-POINT: SparkFun Test Points Bare copper test points for troubleshooting or In-Circuit-Testing. These are used by our Production team for verifying production board runs using pogo-pins on test beds. SparkFun Products: SparkFun LSM9DS1 Breakout <https://www.sparkfun.com/products/13284> SparkFun PSOC <https://www.sparkfun.com/products/13714> SparkFun Load Cell Amplifier <https://www.sparkfun.com/products/13879>
U1 = LT3959QFN:LT3959
U2 = NCN4555:DAVID-HANDY_ON_NCN4555: ON NCN4555; SPICEPREFIX: X
U3 = TXB0108-PWR:TXB0108PWR; MANUFACTURER_PART_NUMBER: TXB0108PWR; VENDOR: Texas Instruments
U4 = SparkFun-IC-Microcontroller:ATSAMD21G: Atmel SAMD21G SMART ARM-Based Microcontroller The Atmel ® | SMART ™ SAM D21 is a series of low-power microcontrollers using the 32-bit ARM ® Cortex ® -M0+ processor, and ranging from 32- to 64-pins with up to 256KB Flash and 32KB of SRAM. The SAM D21 devices operate at a maximum frequency of 48MHz and reach 2.46 CoreMark/MHz. They are designed for simple and intuitive migration with identical peripheral modules, hex compatible code, identical linear address map and pin compatible migration paths between all devices in the product series. All devices include intelligent and flexible peripherals, Atmel Event System for inter-peripheral signaling, and support for capacitive touch button, slider and wheel user interfaces. Datasheet <https://cdn.sparkfun.com/datasheets/Dev/Arduino/Boards/Atmel-42181-SAM-D21_Datasheet.pdf> SparkFun Products SparkFun SAMD21 Mini Breakout <https://www.sparkfun.com/products/13664> (DEV-13664) SparkFun SAMD21 Dev Breakout <https://www.sparkfun.com/products/13672> (DEV-13672); PROD_ID: IC-13064
U6 = SparkFun-IC-Special-Function:SX1509: Semtech SX1509 The SX1509 is a complete ultra low voltage 1.2V to 3.6V General Purpose parallel Input/Output (GPIO) expanders ideal for low power handheld battery powered equipment. This version comes in a 16-channel configuration and allows easy serial expansion of I/O through a standard 400kHz I2C interface. GPIO devices can provide additional control and monitoring when the microcontroller or chipset has insufficient I/O ports, or in systems where serial communication and control from a remote location is advantageous. Datasheet <http://cdn.sparkfun.com/datasheets/BreakoutBoards/sx1509.pdf> SparkFun Products SparkFun 16 Output I/O Expander Breakout - SX1509 <https://www.sparkfun.com/products/13601> (BOB-13601) SparkFun Line Follower Array <https://www.sparkfun.com/products/13582> (SEN-13582); PROD_ID: IC-11311
U7 = TXB0104:TXB0104RUTR; MANUFACTURER_PART_NUMBER: TXB0104RUTR; VENDOR: Texas Instruments
U8 = MCP1826:MCP1826T-3302E/DC; MANUFACTURER_PART_NUMBER: MCP1826T3302EDC; VENDOR: Microchip
X1 = con-molex-micro-fit-3_0:HEADER_POS2_?: Molex - Micro-Fit 3.0 Series connector, 3.00mm (0.118") pitch header, 2 positions.
X2 = adafruit:SMACONNECTOR: SMA Connector 90° DIP SMA Connector, 50 Ohm (4UConnector: 07259)
Y1 = SparkFun-Clocks:CRYSTAL-32.768KHZ: 32.768kHz Crystal Frequency: 32.768kHz Frequency Stability: ±20ppm Load Capacitance: 12.5pF (PTH-2X6 & SMD-3.2X1.5), 6pF (SMD-2X6) SparkFun Products: SparkFun BigTime Watch Kit <https://www.sparkfun.com/products/11734> SparkFun nRF52832 Breakout <https://www.sparkfun.com/products/13990> SparkFun Real Time Clock Module <https://www.sparkfun.com/products/12708>; PROD_ID: XTAL-13062

## Net classes
1 30V: clearance 0.254 mm to class 0